# EAGLE design Microphone Patch Pedal (EAGLE 9.6.1)
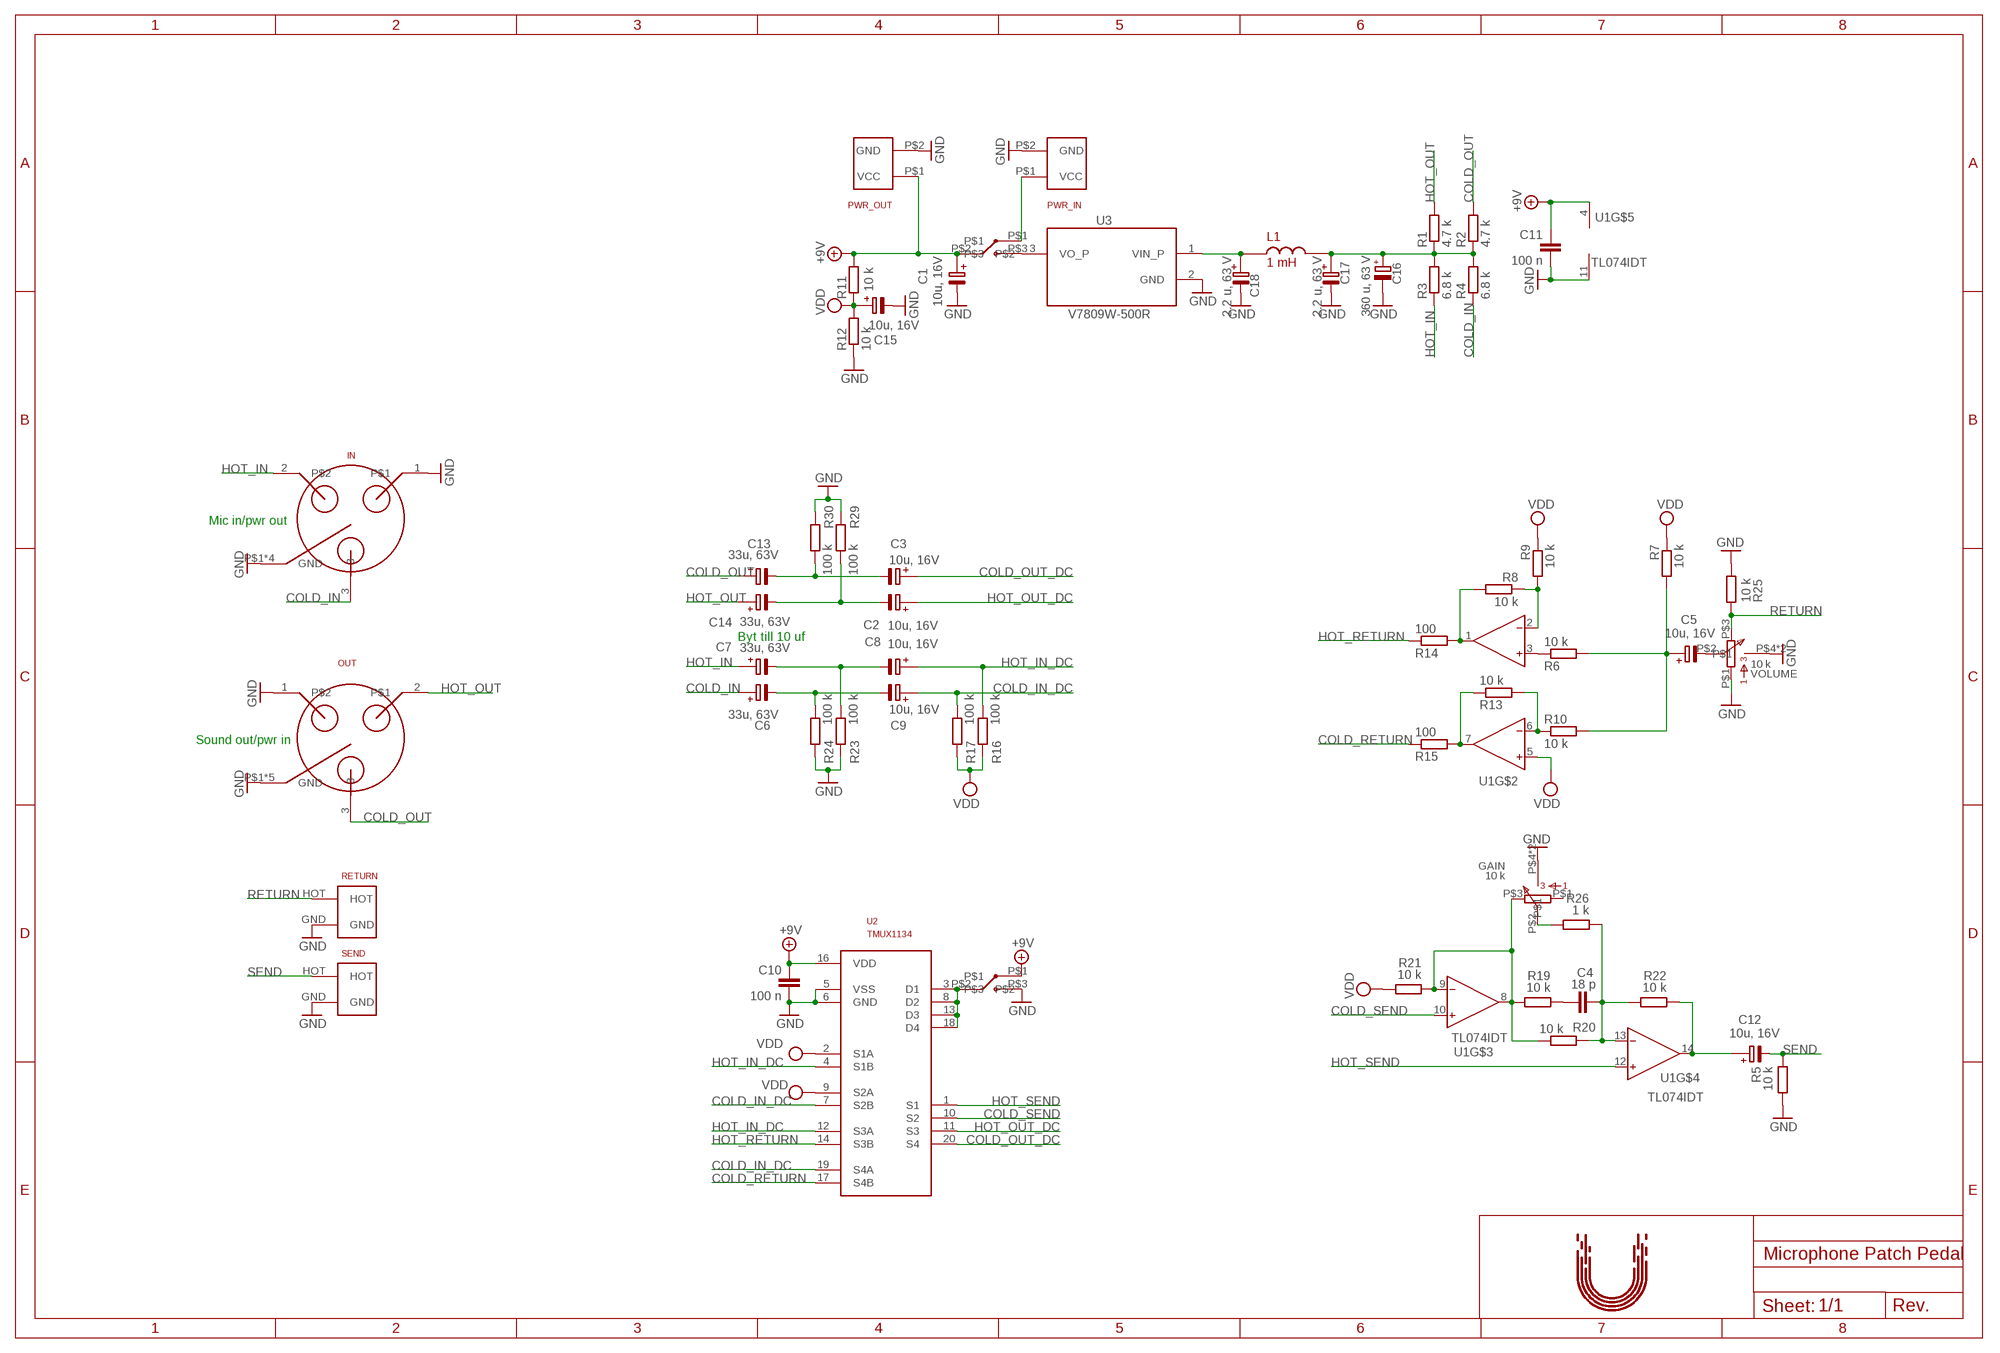
[diagram p0: schematic, sheet 1]

## Parts
BYPASS  BUTTON  [3-HOLES]
C1  10u, 16V  C-PR-SMD-SV-A  [SV-A]
C2  10u, 16V  C-PR-SMD-SV-A  [SV-A]
C3  10u, 16V  C-PR-SMD-SV-A  [SV-A]
C4  18 p  C-EUC0603  [C0603]
C5  10u, 16V  C-PR-SMD-SV-A  [SV-A]
C6  33u, 63V  C-PR-SMD-SV-E/F  [SV-E/F]
C7  33u, 63V  C-PR-SMD-SV-E/F  [SV-E/F]
C8  10u, 16V  C-PR-SMD-SV-A  [SV-A]
C9  10u, 16V  C-PR-SMD-SV-A  [SV-A]
C10  100 n  C-EUC0603  [C0603]
C11  100 n  C-EUC0603  [C0603]
C12  10u, 16V  C-PR-SMD-SV-A  [SV-A]
C13  33u, 63V  C-PR-SMD-SV-E/F  [SV-E/F]
C14  33u, 63V  C-PR-SMD-SV-E/F  [SV-E/F]
C15  10u, 16V  C-PR-SMD-SV-A  [SV-A]
C16  360 u, 63 V  CPOL-EU-PANASONIC_FK_V_H  [PANASONIC_FK_V_H]
C17  2.2 u, 63 V  C-PR-SMD-SV-B  [SV-B]
C18  2.2 u, 63 V  C-PR-SMD-SV-B  [SV-B]
GAIN  10 k  RK09L1140  [RK09L1140]
IN  XLR_FEMALE  [NC3FAH2-S]
L1  1 mH  CBC3225T102KR  [R3225]
OUT  XLR_MALE  [NC3MAH-S]
PWR_IN  PWR  [PWR]
PWR_OUT  PWR  [PWR]
R1  4.7 k  R-EU_R0603  [R0603]
R2  4.7 k  R-EU_R0603  [R0603]
R3  6.8 k  R-EU_R0603  [R0603]
R4  6.8 k  R-EU_R0603  [R0603]
R5  10 k  R-EU_R0603  [R0603]
R6  10 k  R-EU_R0603  [R0603]
R7  10 k  R-EU_R0603  [R0603]
R8  10 k  R-EU_R0603  [R0603]
R9  10 k  R-EU_R0603  [R0603]
R10  10 k  R-EU_R0603  [R0603]
R11  10 k  R-EU_R0603  [R0603]
R12  10 k  R-EU_R0603  [R0603]
R13  10 k  R-EU_R0603  [R0603]
R14  100  R-EU_R0603  [R0603]
R15  100  R-EU_R0603  [R0603]
R16  100 k  R-EU_R0603  [R0603]
R17  100 k  R-EU_R0603  [R0603]
R19  10 k  R-EU_R0603  [R0603]
R20  10 k  R-EU_R0603  [R0603]
R21  10 k  R-EU_R0603  [R0603]
R22  10 k  R-EU_R0603  [R0603]
R23  100 k  R-EU_R0603  [R0603]
R24  100 k  R-EU_R0603  [R0603]
R25  10 k  R-EU_R0603  [R0603]
R26  1 k  R-EU_R0603  [R0603]
R29  100 k  R-EU_R0603  [R0603]
R30  100 k  R-EU_R0603  [R0603]
RETURN  UNBALANCED_INPUT_JACK  [BALANCED_INPUT_JACK]
SEND  UNBALANCED_INPUT_JACK  [BALANCED_INPUT_JACK]
SWITCH  BUTTON  [3-HOLES]
U1  TL074IDT  [SOIC127P600X175-14N]
U2  TMUX1134  [SOP65P640X120-20N]
U3  V7809W-500R  [CONV_V7809W-500R]
U$1  UTBULT_DESIGN4  [UD_4]
VOLUME  10 k  RK09L1140  [RK09L1140]

## Nets
+9V: BYPASS.P$1 C1.+ C10.1 C11.1 PWR_OUT.P$1(VCC) R11.2 SWITCH.P$2 U1.4(V+) U2.16(VDD)
COLD_IN: C6.+ IN.3 R4.1
COLD_IN_DC: C9.+ R17.2 U2.7(S2B) U2.19(S4A)
COLD_OUT: C13.+ OUT.3 R2.2
COLD_OUT_DC: C3.+ U2.20(S4)
COLD_RETURN: R15.1 U2.17(S4B)
COLD_SEND: U1.10(IN+) U2.10(S2)
GND: BYPASS.P$3 C1.- C10.2 C11.2 C15.- C16.- C17.- C18.- GAIN.P$4 GAIN.P$5 IN.1 IN.P$1(GND) IN.P$2(GND) IN.P$3(GND) IN.P$6(GND) OUT.1 OUT.P$1(GND) OUT.P$2(GND) OUT.P$3(GND) OUT.P$4(GND) OUT.P$5(GND) PWR_IN.P$2(GND) PWR_OUT.P$2(GND) R5.2 R12.1 R23.1 R24.1 R25.2 R29.1 R30.1 RETURN.GND SEND.GND U1.11(V-) U2.5(VSS) U2.6(GND) U3.2(GND) VOLUME.P$1 VOLUME.P$4 VOLUME.P$5
HOT_IN: C7.+ IN.2 R3.1
HOT_IN_DC: C8.+ R16.2 U2.4(S1B) U2.12(S3A)
HOT_OUT: C14.+ OUT.2 R1.2
HOT_OUT_DC: C2.+ U2.11(S3)
HOT_RETURN: R14.1 U2.14(S3B)
HOT_SEND: U1.12(IN+) U2.1(S1)
N$2: R6.1 U1.3(IN+)
N$3: R8.2 R14.2 U1.1(OUT)
N$4: R8.1 R9.2 U1.2(IN-)
N$5: R10.1 R13.2 U1.6(IN-)
N$6: R13.1 R15.2 U1.7(OUT)
N$7: C5.- VOLUME.P$2
N$8: C16.+ C17.+ L1.2 R1.1 R2.1 R3.2 R4.2
N$9: GAIN.P$3 R19.2 R20.2 R21.1 U1.8(OUT) U1.9(IN-)
N$10: SWITCH.P$3 U3.3(VO_P)
N$11: C4.1 R19.1
N$12: C4.2 R20.1 R22.2 R26.1 U1.13(IN-)
N$13: C12.+ R22.1 U1.14(OUT)
N$14: C7.- C8.- R23.2
N$15: C6.- C9.- R24.2
N$16: C18.+ L1.1 U3.1(VIN_P)
N$17: GAIN.P$2 R26.2
N$18: C2.- C14.- R29.2
N$19: C3.- C13.- R30.2
N$20: C5.+ R6.2 R7.2 R10.2
N$21: PWR_IN.P$1(VCC) SWITCH.P$1
RETURN: R25.1 RETURN.HOT VOLUME.P$3
SELECTOR: BYPASS.P$2 U2.3(D1) U2.8(D2) U2.13(D3) U2.18(D4)
SEND: C12.- R5.1 SEND.HOT
VDD: C15.+ R7.1 R9.1 R11.1 R12.2 R16.1 R17.1 R21.2 U1.5(IN+) U2.2(S1A) U2.9(S2A)
Unconnected: GAIN.P$1

## Notes on the sheet
- Mic in/pwr out
- Byt till 10 uf
- Sound out/pwr in

## Library data of the parts
BYPASS SWITCH = passives:BUTTON
C1-C3 C5 C8 C9 C12 C15 = passives:C-PR: POLARIZED ELECTROLYTIC/TANTALUM; LINK: https://www.mouser.se/ProductDetail/Nichicon/UWX1C100MCL2GB?qs=Wj%2FVkw3K%252BMB0r5CJ0oBSFw%3D%3D; MFR: Nichicon; MFR-NR: UWX1C100MCL2GB; SUPPLIER: Mouser
C4 C10 C11 = passives:C-EU: CAPACITOR, European symbol; SPICEPREFIX: C
C6 C7 C13 C14 = passives:C-PR: POLARIZED ELECTROLYTIC/TANTALUM; LINK: https://www.mouser.se/ProductDetail/Panasonic/EEE-FK1J330P?qs=qE6bgDGEOCvlingENS6G1A%3D%3D; MFR: Panasonic; MFR-NR: EEE-FK1J330P; SUPPLIER: Mouser
C16 = passives:CPOL-EU-*: Panasonic Aluminium Electrolytic Capacitor Series FK, Type V, Size H [SMT] Source: http://www.panasonic.com/industrial/electronic-components/ Author: Dipl.-Ing. FH Rainer Bayer Hochschule Heilbronn HHN: rainer.bayer@hs-heilbronn.de − http://www.hs-heilbronn.de/rainer.bayer Ingenieurbüro ing-rb: mail@ing-rb.de − http://www.ing-rb.de/; LINK: https://eu.mouser.com/ProductDetail/Nichicon/UCM1J361MNJ1MS?qs=sGAEpiMZZMsh%252B1woXyUXj454OU6nZKUJcaVrXrku8lc%3D; MPN: UCM1J361MNJ1MS; SUPPLIER: Mouser
C17 C18 = passives:C-PR: POLARIZED ELECTROLYTIC/TANTALUM; LINK: https://eu.mouser.com/ProductDetail/United-Chemi-Con/EMVA630ADA2R2MD55G?qs=8LsMxZbc%2FVeR1MWNLLxxJw%3D%3D; MPN: EMVA630ADA2R2MD55G; SUPPLIER: Mouser
GAIN VOLUME = passives:RK09L1140: RK09L1140 Potentiometer
IN = connectors:XLR_FEMALE: Female XLR Jack Neutrik Female XLR jack; LINK: https://www.mouser.se/ProductDetail/Neutrik/NC3FAH2-S?qs=YwPsRIUVAOcGvYuJnFEptA%3D%3D; MFR-NO: NC3FAH2-S; SUPPLIER: Neutrik
L1 = passives:CBC3225T102KR: CBC3225T102KR Inductor 1 mH, 100 mA; LINK: https://eu.mouser.com/ProductDetail/Taiyo-Yuden/CBC3225T102KR?qs=sGAEpiMZZMv126LJFLh8y20aaI5UI0LiYLUtcSjD9tU%3D; MPN: CBC3225T102KR; SUPPLIER: Mouser
OUT = library:XLR_MALE: Male XLR Jack Neutric male XLR jack; LINK: https://www.mouser.se/ProductDetail/Neutrik/NC3MAH-S?qs=YwPsRIUVAOdbWFQwvVs60Q==; MFR-NR: NC3MAH-S; SUPPLIER: Neutrik
PWR_IN PWR_OUT = connectors:PWR
R1-R17 R19-R26 R29 R30 = passives:R-EU_: RESISTOR, European symbol; SPICEPREFIX: R
RETURN SEND = library:UNBALANCED_INPUT_JACK
U1 = ic:TL074IDT: Low noise JFET quad operational amplifier; LINK: https://www.mouser.se/ProductDetail/STMicroelectronics/TL074IDT?qs=xiMLMHqF5JUaM%252BCWVyDQFA%3D%3D; MFR: STMicroelectronics; MFR-NR: TL074IDT; SUPPLIER: Mouser
U2 = ic:TMUX1134: TMUX1134 TMUX1134 Analog selector 4 Channels 1.08 V to 5.5 V; LINK: https://www.mouser.se/ProductDetail/Texas-Instruments/TMUX1134PWR?qs=%252B6g0mu59x7L8VGQncKsYmQ%3D%3D; MPN: TMUX1134PWR; SUPPLIER: Mouser
U3 = power:V7809W-500R: V7809W-500R Power regulator Input up to 72 V, output 9 V 500 mA; LINK: https://eu.mouser.com/ProductDetail/CUI-Inc/V7809W-500R?qs=WyjlAZoYn50ZQqVm%2FTcinw%3D%3D; MPN: V7809W-500R; SUPPLIER: Mouser
U$1 = misc:UTBULT_DESIGN

## Board
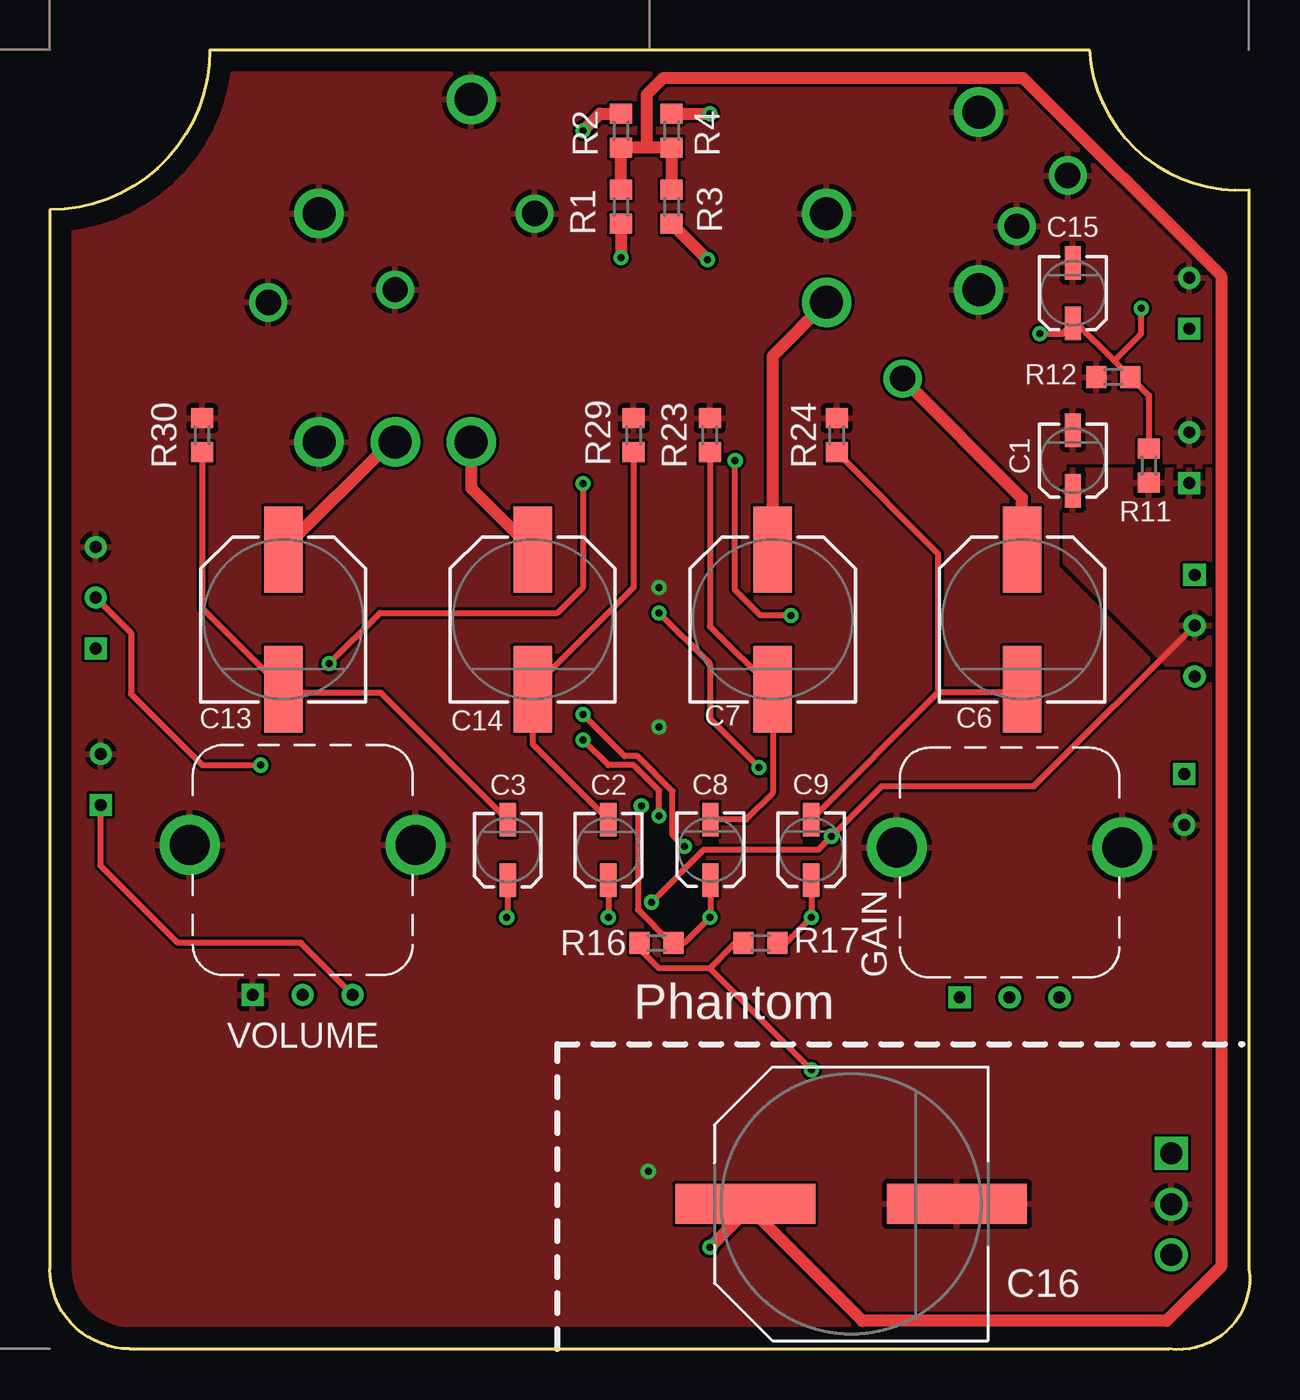
[diagram p1: board, top side]
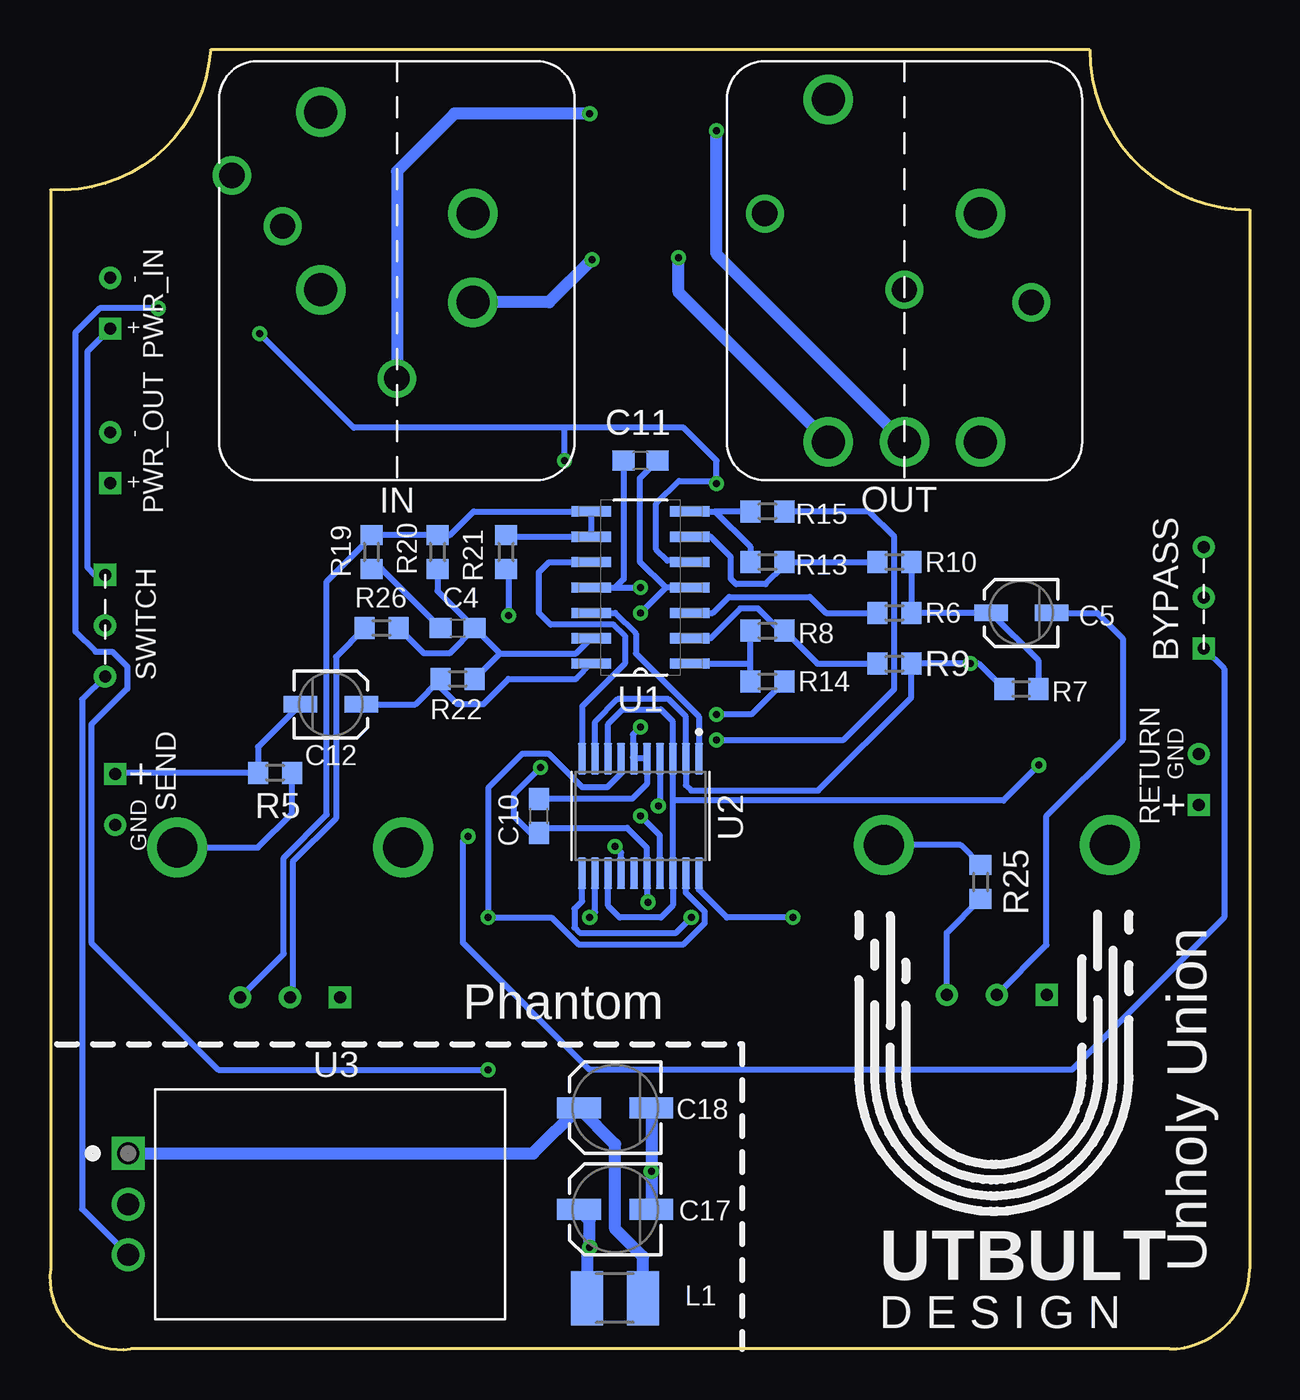
[diagram p2: board, bottom side, seen from below]

Size 60.03 x 65.03 mm. Coordinates in mm from the lower left corner, seen from the top.
Outline: 8,65.03 arc-90 0,57.03 0,4.03 arc90 4,0.03 56,0.03 arc106 60,4.03 60,58.03 arc-90 52,65.03 8,65.03
Copper layers (1*16): Top 0.035mm / dielectric 1.5mm / Bottom 0.035mm
Design rules "default": minimum track width 6mil, minimum drill 0.35mm, track to track 6mil, track to pad 6mil, pad to pad 6mil, via to via 6mil, smd to smd 6mil, copper to edge 40mil, drill to drill 6mil, minimum pad ring 10mil, minimum via ring 8mil, stop-mask expansion 4mil, vias tented up to drill 0mil, thermal gap 10mil

### Footprints (pad centres in the part's own frame; a part is rotated, then mirrored left to right if it is on the bottom)
3-HOLES = drill 0.6 square: P$1 -2.54,0 | drill 0.6: P$2 0,0; P$3 2.54,0
SV-A = smd 1.676 x 0.813: + -1.516,0; - 1.516,0
C0603 = smd 1.1 x 1: 1 -0.85,0; 2 0.85,0
SV-E/F = smd 4.318 x 1.93: + -3.493,0; - 3.493,0
PANASONIC_FK_V_H = smd 7 x 2: + 5.3,0; - -5.3,0
SV-B = smd 2.184 x 1.067: + -1.81,0; - 1.81,0
RK09L1140 = drill 0.6 square: P$1 -2.5,0 | drill 0.6: P$2 0,0; P$3 2.5,0 | drill 2: P$4 -5.65,7.5; P$5 5.65,7.5
NC3FAH2-S = drill 1.651: 1 -3.81,-11.43; 2 3.81,-12.065; P$1 -3.81,-2.54; P$6 3.81,-7.62 | drill 1.27: 3 0,-15.875; P$2 -8.255,-5.715; P$3 -5.715,-8.255
R3225 = smd 1.6 x 2.7: 1 -1.4,0; 2 1.4,0
NC3MAH-S = drill 1.651: 1 3.81,-20.32; 2 -3.81,-20.32; 3 0,-20.32; P$1 -3.81,-3.175; P$2 3.81,-8.89 | drill 1.27: P$3 -6.985,-8.89; P$4 0,-12.7; P$5 6.35,-13.335
PWR = drill 0.6 square: P$1 -1.27,0 | drill 0.6: P$2 1.27,0
R0603 = smd 1 x 1.1: 1 -0.85,0; 2 0.85,0
BALANCED_INPUT_JACK = drill 0.6: GND 1.27,0 | drill 0.6 square: HOT -1.27,0
SOIC127P600X175-14N = smd 1.981 x 0.508: 1 -2.464,3.81; 2 -2.464,2.54; 3 -2.464,1.27; 4 -2.464,0; 5 -2.464,-1.27; 6 -2.464,-2.54; 7 -2.464,-3.81; 8 2.464,-3.81; 9 2.464,-2.54; 10 2.464,-1.27; 11 2.464,0; 12 2.464,1.27; 13 2.464,2.54; 14 2.464,3.81
SOP65P640X120-20N = smd 1.57 x 0.41: 1 -2.87,2.925; 2 -2.87,2.275; 3 -2.87,1.625; 4 -2.87,0.975; 5 -2.87,0.325; 6 -2.87,-0.325; 7 -2.87,-0.975; 8 -2.87,-1.625; 9 -2.87,-2.275; 10 -2.87,-2.925; 11 2.87,-2.925; 12 2.87,-2.275; 13 2.87,-1.625; 14 2.87,-0.975; 15 2.87,-0.325; 16 2.87,0.325; 17 2.87,0.975; 18 2.87,1.625; 19 2.87,2.275; 20 2.87,2.925
CONV_V7809W-500R = drill 1.1 square: 1 -10.1,2.54 | drill 1.1: 2 -10.1,0; 3 -10.1,-2.54

### Placement (x,y rotation side)
BYPASS  2.29,37.62 90 bottom
C1  51.18,44.48 90 top
C2  27.94,25 90 top
C3  22.91,25 90 top
C4  39.62,36.1 0 bottom
C5  11.43,36.86 0 bottom
C6  48.65,36.54 270 top
C7  36.17,36.54 270 top
C8  33.05,25.01 90 top
C9  38.09,25.01 90 top
C10  35.56,26.7 90 bottom
C11  30.48,44.48 180 bottom
C12  45.97,32.29 180 bottom
C13  11.68,36.54 270 top
C14  24.16,36.54 270 top
C15  51.18,52.86 90 top
C16  40.09,7.29 180 top
C17  31.75,7.02 0 bottom
C18  31.75,12.1 0 bottom
GAIN  48.02,17.62 0 top
IN  42.67,64.47 0 bottom
L1  31.75,2.57 180 bottom
OUT  17.27,65.74 0 bottom
PWR_IN  57.02,52.36 90 bottom
PWR_OUT  57.02,44.63 90 bottom
R1  28.57,57.18 270 top
R2  28.57,60.99 90 top
R3  31.11,57.18 90 top
R4  31.11,60.99 270 top
R5  48.77,28.86 0 bottom
R6  17.78,36.86 0 bottom
R7  11.43,33.05 0 bottom
R8  24.13,35.97 180 bottom
R9  17.78,34.32 180 bottom
R10  17.78,39.4 0 bottom
R11  54.99,44.23 270 top
R12  53.21,48.67 0 top
R13  24.13,39.4 0 bottom
R14  24.13,33.43 180 bottom
R15  24.13,41.94 180 bottom
R16  30.35,20.35 0 top
R17  35.56,20.35 0 top
R19  43.94,39.91 90 bottom
R20  40.64,39.91 90 bottom
R21  37.21,39.91 270 bottom
R22  39.62,33.56 0 bottom
R23  33.02,45.75 270 top
R24  39.37,45.75 270 top
R25  13.46,23.4 90 bottom
R26  43.43,36.1 180 bottom
R29  29.21,45.75 270 top
R30  7.62,45.75 270 top
RETURN  2.54,28.53 90 bottom
SEND  56.77,27.53 270 bottom
SWITCH  57.28,36.23 270 bottom
U1  30.48,38.13 180 bottom
U2  30.48,26.7 270 bottom
U3  46.02,7.27 0 bottom
U$1  12.83,14.89 0 bottom
VOLUME  12.65,17.75 0 top

### Tracks (layer width: path | path; a pad name or v marks a point on that pad's centre or on a via)
+9V  (via drill 0.35)
  Top 0.305: v30.1,22.38 32.72,25 38.43,25 v39.12,25.69 41.62,28.2 49.25,28.2 SWITCH.P$2 | v30.48,36.86 33.02,34.32 33.02,31.59 v35.48,29.12
  Bottom 0.305: v30.1,22.38 30.16,22.44 U2.16 30.16,25.11 31.15,26.11 35.31,26.11 C10.1 35.98,25.85 36.83,26.7 36.83,27.78 v35.48,29.12 | U1.4 29.21,38.13 | 29.21,38.13 v30.48,36.86 | C11.1 30.52,43.59 30.52,39.44 29.21,38.13 | BYPASS.P$1 1.27,34.07 1.27,21.62 8.89,14 33.02,14 39.37,20.35 39.37,25.43 v39.12,25.69
  pour Top: 55.88,34.32 59.69,34.32 59.69,43.97 50.8,43.97 50.8,39.4
COLD_IN  (via drill 0.35)
  Top 0.61: C6.+ 48.65,42.62 IN.3 42.67,48.8 | R4.1 v33.02,61.84
  Bottom 0.61: v33.02,61.84 39.79,61.84 42.67,58.96 IN.3
COLD_IN_DC  (via drill 0.35)
  Top 0.305: C9.+ v38.1,21.62 36.83,20.35 R17.2
  Bottom 0.305: U2.19 28.2,22.85 27.26,21.91 27.26,21.34 28.32,20.28 33.59,20.28 34.94,21.62 v38.1,21.62 38.1,28.1 36.4,29.8 35.06,29.8 33.39,28.14 32.15,28.14 31.45,28.83 U2.7
COLD_OUT  (via drill 0.35)
  Top 0.61: OUT.3 17.07,45.42 C13.+ | v26.67,60.99 27.52,61.84 R2.2
  Bottom 0.61: OUT.3 26.67,54.82 v26.67,60.99
COLD_OUT_DC  (via drill 0.35)
  Top 0.305: C3.+ 22.91,21.67 v22.86,21.62
  Bottom 0.305: v22.86,21.62 26.16,21.62 27.55,23.02 U2.20
COLD_RETURN  (via drill 0.35)
  Top 0.305: v30.48,26.7 30.48,27.97 29.21,29.24 27.94,29.24 v26.67,30.51
  Bottom 0.305: U2.17 29.5,25.73 v30.48,26.7 | v26.67,30.51 20.32,30.51 17.78,33.05 17.78,40.67 19.05,41.94 R15.1
COLD_SEND
  Bottom 0.305: U1.10 35.05,39.4 35.56,38.89 35.56,36.86 34.98,36.28 31.83,36.28 31.27,35.72 31.27,34.32 33.41,32.19 U2.10
GND  (via drill 0.35)
  Bottom 0.305: C10.2 30.9,27.55 30.16,28.3 U2.5 U2.6 30.86,29.63 30.86,30.77 v30.48,31.15 | GAIN.P$5 49.63,25.12 47.92,26.83 R5.2 | U1.11 31.75,38.13 | 31.75,38.13 v30.48,38.13 | R25.2 14.46,25.25 VOLUME.P$5 | C11.2 31.33,38.55 31.75,38.13
  Bottom 0.61: C18.- v29.94,8.92 C17.-
  pour Top (rank 2): 0,65.18 60.07,65.18 60.07,0.03 0,0.03
HOT_IN  (via drill 0.35)
  Top 0.61: C7.+ 36.17,49.71 IN.2 | R3.1 v32.91,54.53
  Bottom 0.61: v32.91,54.53 35.05,52.4 IN.2
HOT_IN_DC  (via drill 0.35)
  Top 0.305: C8.+ 33.05,21.66 v33.02,21.62 31.75,20.35 R16.2 31.08,20.35 29.42,22.01 29.42,24.16 29.42,27.04 v29.59,27.21
  Bottom 0.305: v33.02,21.62 32.76,21.89 U2.12 | U2.4 29.5,27.3 v29.59,27.21
HOT_OUT  (via drill 0.35)
  Top 0.61: OUT.2 21.08,43.11 C14.+ | R1.2 v28.57,54.64
  Bottom 0.61: OUT.2 28.57,52.91 v28.57,54.64
HOT_OUT_DC  (via drill 0.35)
  Top 0.305: C2.+ v27.94,21.63 v27.94,21.62
  Bottom 0.305: v27.94,21.62 28.7,20.86 33.53,20.86 33.79,21.12 33.79,22.05 33.41,22.44 U2.11
HOT_RETURN  (via drill 0.35)
  Top 0.305: v31.75,25.17 31.16,25.76 31.16,27.94 29.4,29.7 28.75,29.7 v26.67,31.78
  Bottom 0.305: U2.14 31.45,24.87 v31.75,25.17 | R14.1 24.93,31.78 v26.67,31.78
HOT_SEND
  Bottom 0.305: U1.12 31.75,36.86 30.71,35.82 30.71,34.83 27.55,31.68 U2.1
N$2
  Bottom 0.305: U1.3 26.85,36.86 26.05,37.67 22,37.67 21.2,36.86 R6.1
N$3
  Bottom 0.305: R14.2 24.98,34.32 | 24.98,34.32 R8.2 | U1.1 24.98,34.32
N$4
  Bottom 0.305: R9.2 21.63,34.32 R8.1 23.5,35.97 24.61,37.08 25.48,37.08 25.55,37.01 25.91,36.65 26.97,35.59 U1.2
N$5
  Bottom 0.305: U1.6 26.98,40.67 25.96,39.66 25.96,38.56 25.7,38.3 24.22,38.3 23.28,39.24 R13.2 R10.1
N$6
  Bottom 0.305: U1.7 26.75,41.94 | 26.75,41.94 24.98,40.18 R13.1 | R15.2 26.75,41.94
N$7
  Bottom 0.305: C5.- 7.62,36.86 6.35,35.59 6.35,30.51 10.16,26.7 10.16,20.24 VOLUME.P$2
N$8  (via drill 0.35)
  Top 0.61: 29.85,60.14 R2.1 R1.1 | 29.85,60.14 29.85,62.79 30.7,63.64 48.7,63.64 58.6,53.73 58.6,4.15 55.88,1.43 40.66,1.43 C16.+ 34.8,6.89 v33.02,5.11 | 29.85,60.14 R4.2 R3.2
  Bottom 0.61: C17.+ 33.02,6.48 v33.02,5.11 33.15,4.98 L1.2
N$9
  Bottom 0.305: GAIN.P$3 48.34,19.81 48.34,24.61 46.18,26.76 46.18,38.44 43.94,40.67 R19.2 R20.2 40.01,40.76 38.82,41.94 U1.8 U1.9 37.12,40.67 R21.1
N$10
  Bottom 0.305: SWITCH.P$3 58.42,32.55 58.42,7.03 U3.3
N$11
  Bottom 0.305: C4.1 43.43,39.06 R19.1
N$12
  Bottom 0.305: C4.2 40.64,37.97 R20.1 | C4.2 40.04,34.83 41.31,34.83 R26.1 | C4.2 37.5,34.83 | 37.5,34.83 33.71,34.83 U1.13 | R22.2 37.5,34.83
N$13
  Bottom 0.305: U1.14 33.71,33.56 37.08,33.56 38.35,32.29 39.62,32.29 40.47,33.14 R22.1 41.74,32.29 C12.+
N$14
  Top 0.305: C8.- 34.83,26.53 36.17,27.86 C7.- 33.02,36.19 R23.2
N$15
  Top 0.305: C6.- 48.48,32.87 44.44,32.87 | 44.44,32.87 C9.- | R24.2 44.44,39.83 44.44,32.87
N$16
  Bottom 0.61: L1.1 30.35,4.65 31.74,6.04 31.74,10.28 C18.+ 35.85,9.81 U3.1
N$17
  Bottom 0.305: R26.2 45.72,34.66 45.72,26.58 47.88,24.42 47.88,17.76 GAIN.P$2
N$18
  Top 0.305: C14.- 24.16,31.78 | 24.16,31.78 24.16,30.3 C2.- | R29.2 29.21,38.13 24.13,33.05 24.13,31.81 24.16,31.78
N$19
  Top 0.305: C3.- 16.56,32.86 11.86,32.86 C13.- 7.62,37.1 R30.2
N$20
  Bottom 0.305: R10.2 R6.2 C5.+ 10.58,34.5 R7.2
N$21
  Bottom 0.305: PWR_IN.P$1 58.17,49.94 58.17,39.15 57.78,38.77 SWITCH.P$1
RETURN
  Top 0.305: VOLUME.P$3 12.55,20.35 6.4,20.35 2.54,24.21 RETURN.HOT
  Bottom 0.305: VOLUME.P$3 15.15,20.86 R25.1
SELECTOR  (via drill 0.35)
  Top 0.305: BYPASS.P$2 4.06,35.85 4.06,32.8 7.62,29.24 v10.54,29.24
  Bottom 0.305: U2.8 32.1,31.3 31.37,32.04 29.46,32.04 28.86,31.43 U2.3 28.86,27.46 | U2.13 32.1,22.2 31.52,21.62 29.46,21.62 28.86,22.23 U2.18 28.86,27.46 | v10.54,29.24 12.32,27.46 28.86,27.46
SEND
  Bottom 0.305: SEND.HOT 56.7,28.86 R5.1 49.62,30.16 C12.-
VDD  (via drill 0.35)
  Top 0.305: C15.+ 51.21,51.38 | C15.+ 51.39,51.35 53.26,49.48 | 53.26,49.48 R12.2 54.99,47.75 R11.1 | 53.26,49.48 54.61,50.83 v54.61,52.1 | 33.02,19.08 34.29,20.35 R17.1 | 33.02,19.08 30.48,19.08 29.5,20.06 R16.1 | 33.02,19.08 v38.1,14 | v37.08,36.74 35.56,36.74 34.29,38.01 v34.29,44.48 | C15.+ 50.66,50.83 v49.53,50.83 | v13.97,34.32 16.51,36.86 25.4,36.86 26.67,38.13 v26.67,43.34
  Bottom 0.305: v54.61,52.1 57.55,52.1 58.76,50.89 58.76,35.93 57.76,34.93 56.92,34.93 56.16,34.17 56.16,33.08 57.96,31.28 57.96,20.35 51.61,14 v38.1,14 | U2.9 32.76,31.41 31.62,32.54 29.08,32.54 28.2,31.67 U2.2 28.2,28.24 27.94,27.97 21.59,27.97 16.93,32.63 R9.1 v13.97,34.32 13.55,34.32 R7.1 | R21.2 37.08,38.93 v37.08,36.74 | U1.5 28.09,39.48 29.13,39.48 29.69,40.04 29.69,42.32 28.55,43.47 26.8,43.47 v26.67,43.34 26.67,44.48 28.32,46.13 34.29,46.13 | v34.29,44.48 34.29,46.13 | 34.29,46.13 44.83,46.13 v49.53,50.83

### Text on the board
tNames: Phantom
bNames: Unholy Union | Phantom